# Altium project shift_reg_breakout.PrjPcb
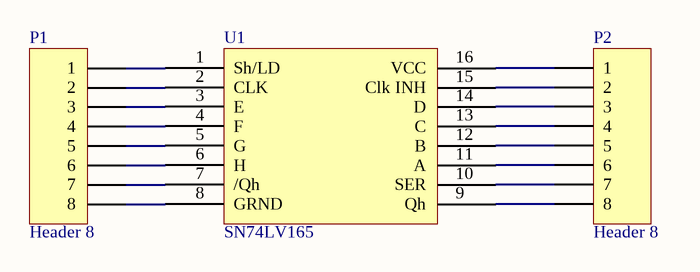
[diagram p0: shift_reg_breakout.SchDoc]
1 sheet, 3 parts. Net scope: global (net labels, ports and power ports of the same name join across sheets).
Board file: shift_reg_breakout.PcbDoc

## Sheet shift_reg_breakout.SchDoc
size Letter

### Parts
P1  Header 8  [HDR1X8]
P2  Header 8  [HDR1X8]
U1  SN74LV165  [SOP16_Hand]

### Nets
NetP1_1: P1.1 U1.1(Sh/LD)
NetP1_2: P1.2 U1.2(CLK)
NetP1_3: P1.3 U1.3(E)
NetP1_4: P1.4 U1.4(F)
NetP1_5: P1.5 U1.5(G)
NetP1_6: P1.6 U1.6(H)
NetP1_7: P1.7 U1.7(/Qh)
NetP1_8: P1.8 U1.8(GRND)
NetP2_1: P2.1 U1.16(VCC)
NetP2_2: P2.2 U1.15(Clk_INH)
NetP2_3: P2.3 U1.14(D)
NetP2_4: P2.4 U1.13(C)
NetP2_5: P2.5 U1.12(B)
NetP2_6: P2.6 U1.11(A)
NetP2_7: P2.7 U1.10(SER)
NetP2_8: P2.8 U1.9(Qh)

### Library data of the parts
P1 P2 = Header 8: Header, 8-Pin; LatestRevisionDate: 17-Jul-2002; LatestRevisionNote: Re-released for DXP Platform.; Publisher: Altium Limited